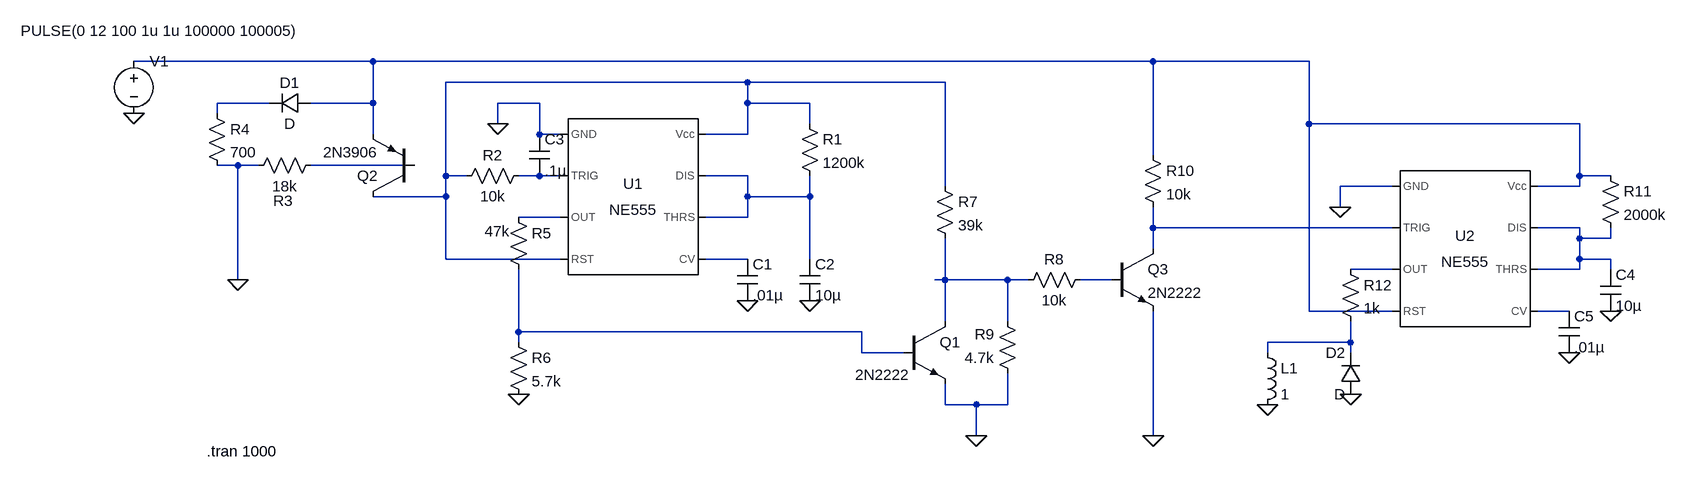
[diagram p0: schematic Automotive Burgular Alarm.asc]
Automotive Burgular Alarm.asc, the LTspice schematic file:
Version 4
SHEET 1 1848 680
WIRE -160 -48 -528 -48
WIRE 1040 -48 -160 -48
WIRE 1280 -48 1040 -48
WIRE 416 -16 -48 -16
WIRE 720 -16 416 -16
WIRE -320 16 -400 16
WIRE -160 16 -160 -48
WIRE -160 16 -256 16
WIRE 96 16 32 16
WIRE 416 16 416 -16
WIRE 512 16 416 16
WIRE -400 32 -400 16
WIRE 32 48 32 16
WIRE 512 48 512 16
WIRE 1280 48 1280 -48
WIRE 1696 48 1280 48
WIRE -160 64 -160 16
WIRE 96 64 96 16
WIRE 128 64 96 64
WIRE 416 64 416 16
WIRE 416 64 352 64
WIRE 1040 96 1040 -48
WIRE -368 112 -400 112
WIRE -336 112 -368 112
WIRE -96 112 -256 112
WIRE -48 128 -48 -16
WIRE -16 128 -48 128
WIRE 96 128 64 128
WIRE 128 128 96 128
WIRE 416 128 352 128
WIRE 1696 128 1696 48
WIRE 1744 128 1696 128
WIRE 720 144 720 -16
WIRE 1408 144 1328 144
WIRE 1696 144 1696 128
WIRE 1696 144 1632 144
WIRE -48 160 -48 128
WIRE -48 160 -160 160
WIRE 416 160 416 128
WIRE 512 160 512 128
WIRE 512 160 416 160
WIRE 1328 176 1328 144
WIRE 128 192 64 192
WIRE 416 192 416 160
WIRE 416 192 352 192
WIRE 1040 208 1040 176
WIRE 1408 208 1040 208
WIRE 1696 208 1632 208
WIRE 1696 224 1696 208
WIRE 1744 224 1744 208
WIRE 1744 224 1696 224
WIRE 1040 240 1040 208
WIRE -48 256 -48 160
WIRE 128 256 -48 256
WIRE 416 256 352 256
WIRE 512 256 512 160
WIRE 1696 256 1696 224
WIRE 1744 256 1696 256
WIRE 1408 272 1344 272
WIRE 1696 272 1696 256
WIRE 1696 272 1632 272
WIRE 1744 272 1744 256
WIRE -368 288 -368 112
WIRE 720 288 720 224
WIRE 720 288 704 288
WIRE 816 288 720 288
WIRE 848 288 816 288
WIRE 976 288 928 288
WIRE 1280 336 1280 48
WIRE 1408 336 1280 336
WIRE 1680 336 1632 336
WIRE 720 352 720 288
WIRE 816 352 816 288
WIRE 64 368 64 272
WIRE 592 368 64 368
WIRE 64 384 64 368
WIRE 1344 384 1344 352
WIRE 1344 384 1216 384
WIRE 592 400 592 368
WIRE 656 400 592 400
WIRE 1216 400 1216 384
WIRE 1344 400 1344 384
WIRE 720 480 720 448
WIRE 768 480 720 480
WIRE 816 480 816 432
WIRE 816 480 768 480
WIRE 768 528 768 480
WIRE 1040 528 1040 336
FLAG 416 320 0
FLAG 512 320 0
FLAG 32 48 0
FLAG 64 464 0
FLAG 768 528 0
FLAG 1040 528 0
FLAG -528 32 0
FLAG 1744 336 0
FLAG 1680 400 0
FLAG 1344 464 0
FLAG 1328 176 0
FLAG -368 288 0
FLAG 1216 480 0
SYMBOL Misc\\NE555 240 160 R0
SYMATTR InstName U1
SYMBOL cap 400 256 R0
SYMATTR InstName C1
SYMATTR Value .01µ
SYMBOL cap 496 256 R0
SYMATTR InstName C2
SYMATTR Value 10µ
SYMBOL res 496 32 R0
SYMATTR InstName R1
SYMATTR Value 1200k
SYMBOL res 80 112 R90
WINDOW 0 0 56 VBottom 2
WINDOW 3 32 56 VTop 2
SYMATTR InstName R2
SYMATTR Value 10k
SYMBOL cap 80 64 R0
SYMATTR InstName C3
SYMATTR Value .1µ
SYMBOL res -240 96 R90
WINDOW 0 86 58 VBottom 2
WINDOW 3 32 56 VTop 2
SYMATTR InstName R3
SYMATTR Value 18k
SYMBOL res -416 16 R0
SYMATTR InstName R4
SYMATTR Value 700
SYMBOL res 48 176 R0
WINDOW 3 -36 37 Left 2
SYMATTR Value 47k
SYMATTR InstName R5
SYMBOL res 48 368 R0
SYMATTR InstName R6
SYMATTR Value 5.7k
SYMBOL npn 656 352 R0
WINDOW 3 -74 82 Left 2
SYMATTR Value 2N2222
SYMATTR InstName Q1
SYMBOL res 704 128 R0
SYMATTR InstName R7
SYMATTR Value 39k
SYMBOL res 944 272 R90
WINDOW 0 0 56 VBottom 2
WINDOW 3 32 56 VTop 2
SYMATTR InstName R8
SYMATTR Value 10k
SYMBOL res 832 448 R180
WINDOW 0 36 76 Left 2
WINDOW 3 36 40 Left 2
SYMATTR InstName R9
SYMATTR Value 4.7k
SYMBOL npn 976 240 R0
SYMATTR InstName Q3
SYMATTR Value 2N2222
SYMBOL res 1024 80 R0
SYMATTR InstName R10
SYMATTR Value 10k
SYMBOL diode -256 0 R90
WINDOW 0 0 32 VBottom 2
WINDOW 3 32 32 VTop 2
SYMATTR InstName D1
SYMBOL voltage -528 -64 R0
WINDOW 3 -174 -31 Left 2
WINDOW 123 0 0 Left 2
WINDOW 39 0 0 Left 2
SYMATTR Value PULSE(0 12 100 1u 1u 100000 100005)
SYMATTR InstName V1
SYMBOL Misc\\NE555 1520 240 R0
SYMATTR InstName U2
SYMBOL res 1728 112 R0
SYMATTR InstName R11
SYMATTR Value 2000k
SYMBOL cap 1728 272 R0
SYMATTR InstName C4
SYMATTR Value 10µ
SYMBOL cap 1664 336 R0
SYMATTR InstName C5
SYMATTR Value .01µ
SYMBOL res 1328 256 R0
SYMATTR InstName R12
SYMATTR Value 1k
SYMBOL diode 1360 464 R180
WINDOW 0 24 64 Left 2
WINDOW 3 24 0 Left 2
SYMATTR InstName D2
SYMBOL pnp -96 160 R180
SYMATTR InstName Q2
SYMATTR Value 2N3906
SYMBOL ind 1200 384 R0
SYMATTR InstName L1
SYMATTR Value 1
TEXT -416 552 Left 2 !.tran 1000

The netlist it stands for:
* Automotive Burgular Alarm.asc
XU1 0 N005 N007 N002 N010 N006 N006 N002 NE555  ; pins GND TRIG OUT RST CV THRS DIS Vcc
C1 N010 0 .01µ
C2 N006 0 10µ
R1 N002 N006 1200k
R2 N005 N002 10k
C3 0 N005 .1µ
R3 N004 0 18k
R4 N003 0 700
R5 N007 N015 47k
R6 N015 0 5.7k
Q1 N012 N015 0 0 2N2222
R7 N002 N012 39k
R8 N013 N012 10k
R9 0 N012 4.7k
Q3 N008 N013 0 0 2N2222
R10 N001 N008 10k
D1 N001 N003 D
V1 N001 0 PULSE(0 12 100 1u 1u 100000 100005)
XU2 0 N008 N011 N001 N014 N009 N009 N001 NE555  ; pins GND TRIG OUT RST CV THRS DIS Vcc
R11 N001 N009 2000k
C4 N009 0 10µ
C5 N014 0 .01µ
R12 N011 N016 1k
D2 0 N016 D
Q2 N002 N004 N001 0 2N3906
L1 N016 0 1
.model D D
.lib standard.dio
.model NPN NPN
.model PNP PNP
.lib standard.bjt
.tran 1000
.lib NE555.sub
.backanno
.end